# EAGLE design device (EAGLE 6.6.0)
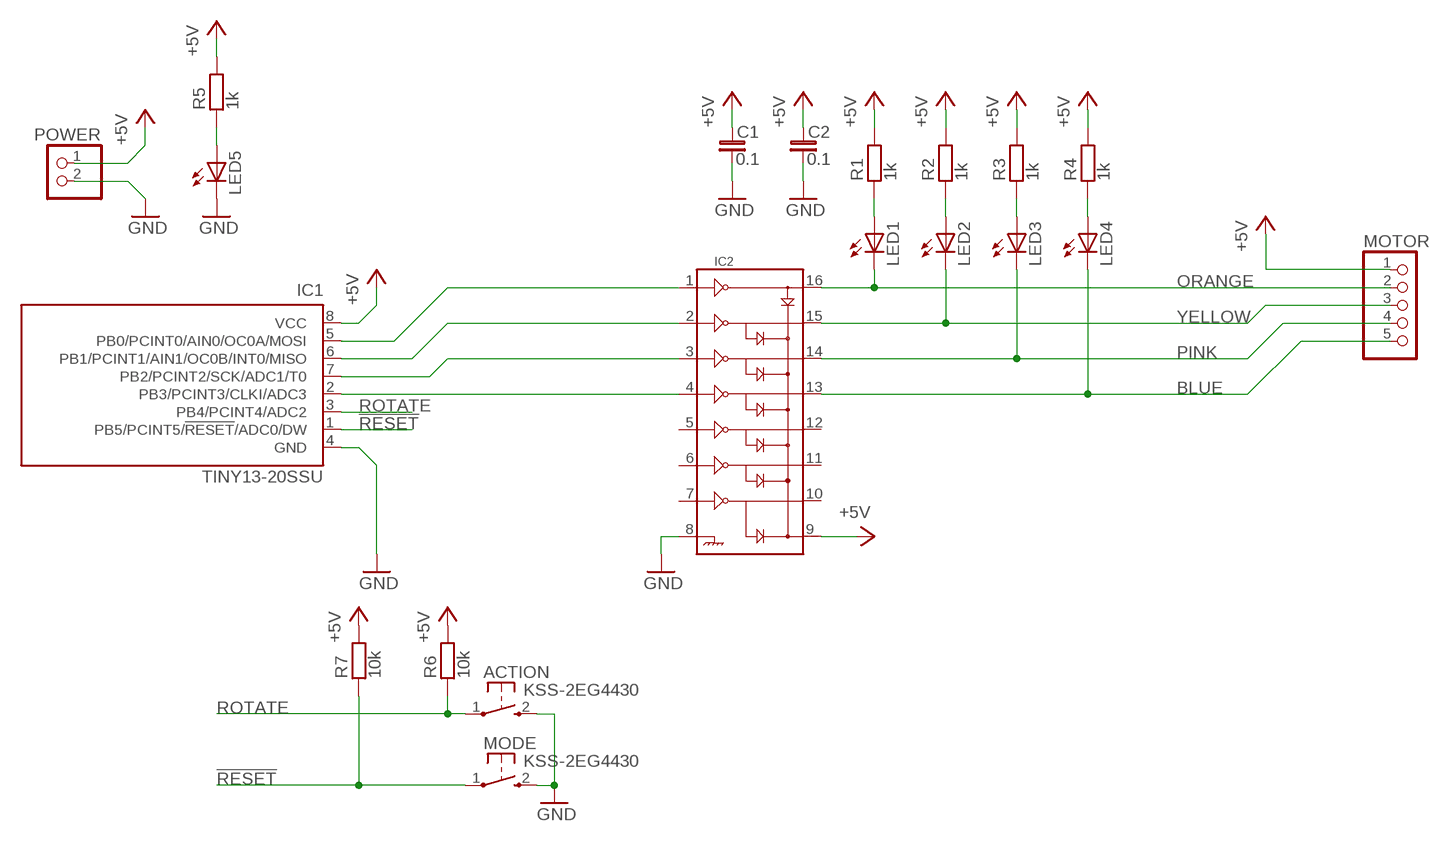
[diagram p0: schematic, sheet 1]

## Parts
ACTION  KSS-2EG4430  [KSS-2EG4430]
C1  0.1  C_0805  [C0805]
C2  0.1  C_0805  [C0805]
IC1  TINY13-20SSU  [8S1]
IC2  ULN2003D  [SO16]
LED1  LEDCHIPLED_0805  [CHIPLED_0805]
LED2  LEDCHIPLED_0805  [CHIPLED_0805]
LED3  LEDCHIPLED_0805  [CHIPLED_0805]
LED4  LEDCHIPLED_0805  [CHIPLED_0805]
LED5  LEDCHIPLED_0805  [CHIPLED_0805]
MODE  KSS-2EG4430  [KSS-2EG4430]
MOTOR  PINHD-1X5_2.54  [1X05]
POWER  PINHD-1X2_2.54  [1X02]
R1  1k  R_0805  [R0805]
R2  1k  R_0805  [R0805]
R3  1k  R_0805  [R0805]
R4  1k  R_0805  [R0805]
R5  1k  R_0805  [R0805]
R6  10k  R_0805  [R0805]
R7  10k  R_0805  [R0805]

## Nets
!RESET: IC1.1(PB5/PCINT5/!RESET!/ADC0/DW) MODE.1(P) R7.1
+5V: C1.1 C2.1 IC1.8(VCC) IC2.9 MOTOR.1 POWER.1 R1.2 R2.2 R3.2 R4.2 R5.2 R6.2 R7.2
BLUE: IC2.13 LED4.C MOTOR.5
GND: ACTION.2(S) C1.2 C2.2 IC1.4(GND) IC2.8 LED5.C MODE.2(S) POWER.2
N$1: LED1.A R1.1
N$2: LED2.A R2.1
N$3: LED3.A R3.1
N$4: LED4.A R4.1
N$5: LED5.A R5.1
N$6: IC1.5(PB0/PCINT0/AIN0/OC0A/MOSI) IC2.1
N$7: IC1.6(PB1/PCINT1/AIN1/OC0B/INT0/MISO) IC2.2
N$8: IC1.7(PB2/PCINT2/SCK/ADC1/T0) IC2.3
N$9: IC1.2(PB3/PCINT3/CLKI/ADC3) IC2.4
ORANGE: IC2.16 LED1.C MOTOR.2
PINK: IC2.14 LED3.C MOTOR.4
ROTATE: ACTION.1(P) IC1.3(PB4/PCINT4/ADC2) R6.1
YELLOW: IC2.15 LED2.C MOTOR.3
Unconnected: IC2.5 IC2.6 IC2.7 IC2.10 IC2.11 IC2.12

## Library data of the parts
ACTION MODE = buttons:KSS-2EG4430: Size: 3x6mm Height: 5mm from PCB Rating: DC12v 50mA Travel: 0.25±0.10mm Operating Force: 180±50gf Return Force: 60gf min Contact resistance: 100m? max Insulation resistance: 100M? min Operating life?50,000 cycles
C1 C2 = rc-master-smd:C_: NON-POLARIZED CAP
IC1 = avr:TINY13: 8-bit AVR Microcontroller with 1K Bytes In-System Programmable Flash Source: http://www.atmel.com/dyn/resources/prod_documents/2535S.pdf
IC2 = transistor-arrays:ULN2003: OUTPUT CURRENT 500mA PER DRIVER (600mA PEAK) OUTPUT VOLTAGE 50V
LED1-LED5 = led:LED: LED OSRAM: - CHIPLED LG R971, LG N971, LY N971, LG Q971, LY Q971, LO R971, LY R971 LH N974, LH R974 LS Q976, LO Q976, LY Q976 LO Q996 - Hyper CHIPLED LW Q18S LB Q993, LB Q99A, LB R99A - SideLED LS A670, LO A670, LY A670, LG A670, LP A670 LB A673, LV A673, LT A673, LW A673 LH A674 LY A675 LS A676, LA A676, LO A676, LY A676, LW A676 LS A679, LY A679, LG A679 - Hyper Micro SIDELED® LS Y876, LA Y876, LO Y876, LY Y876 LT Y87S - SmartLED LW L88C, LW L88S LB L89C, LB L89S, LG L890 LS L89K, LO L89K, LY L89K LS L896, LA L896, LO L896, LY L896 - TOPLED LS T670, LO T670, LY T670, LG T670, LP T670 LSG T670, LSP T670, LSY T670, LOP T670, LYG T670 LG T671, LOG T671, LSG T671 LB T673, LV T673, LT T673, LW T673 LH T674 LS T676, LA T676, LO T676, LY T676, LB T676, LH T676, LSB T676, LW T676 LB T67C, LV T67C, LT T67C, LS T67K, LO T67K, LY T67K, LW E67C LS E67B, LA E67B, LO E67B, LY E67B, LB E67C, LV E67C, LT E67C LW T67C LS T679, LY T679, LG T679 LS T770, LO T770, LY T770, LG T770, LP T770 LB T773, LV T773, LT T773, LW T773 LH T774 LS E675, LA E675, LY E675, LS T675 LS T776, LA T776, LO T776, LY T776, LB T776 LHGB T686 LT T68C, LB T68C - Hyper Mini TOPLED® LB M676 - Mini TOPLED Santana® LG M470 LS M47K, LO M47K, LY M47K Source: http://www.osram.convergy.de - LUMILED® LXK2-PW12-R00, LXK2-PW12-S00, LXK2-PW14-U00, LXK2-PW14-V00 LXK2-PM12-R00, LXK2-PM12-S00, LXK2-PM14-U00 LXK2-PE12-Q00, LXK2-PE12-R00, LXK2-PE12-S00, LXK2-PE14-T00, LXK2-PE14-U00 LXK2-PB12-K00, LXK2-PB12-L00, LXK2-PB12-M00, LXK2-PB14-N00, LXK2-PB14-P00, LXK2-PB14-Q00 LXK2-PR12-L00, LXK2-PR12-M00, LXK2-PR14-Q00, LXK2-PR14-R00 LXK2-PD12-Q00, LXK2-PD12-R00, LXK2-PD12-S00 LXK2-PH12-R00, LXK2-PH12-S00 LXK2-PL12-P00, LXK2-PL12-Q00, LXK2-PL12-R00 Source: www.luxeon.com
MOTOR = pinhead-fixdrills:PINHD-1X5: PIN HEADER
POWER = pinhead-fixdrills:PINHD-1X2: PIN HEADER
R1-R7 = rc-master-smd:R_: RESISTOR

## Board
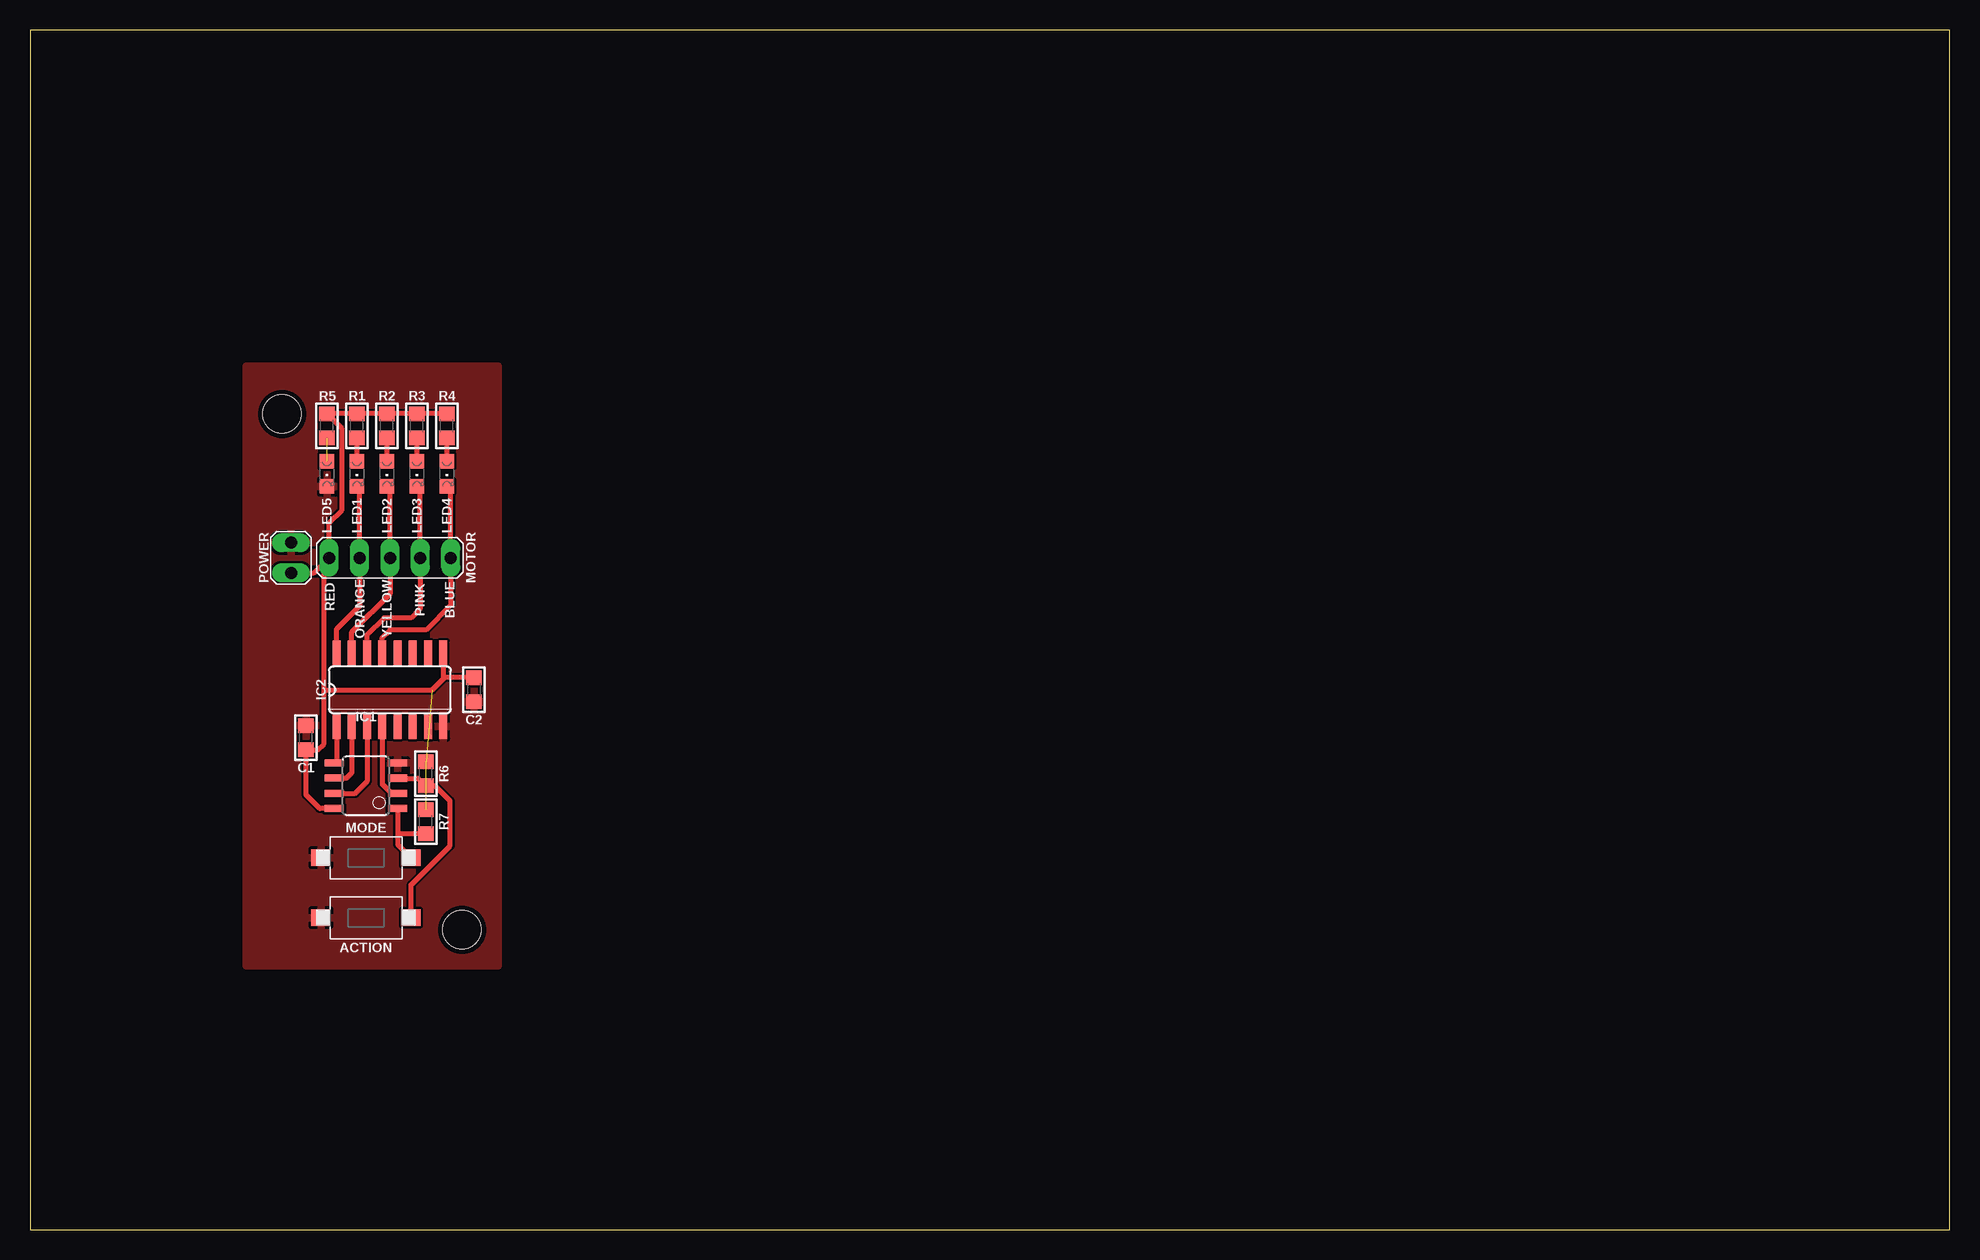
[diagram p1: board, top side]

Size 160 x 100 mm. Coordinates in mm from the lower left corner, seen from the top.
Outline: 0,0 160,0 160,100 0,100 0,0
Copper layers (1*16): Top 0.018mm / dielectric 1.5011mm / Bottom 0.018mm
Design rules "tepro-speed-18mkm": minimum track width 0.2mm, minimum drill 0.4mm, track to track 0.2mm, track to pad 0.2mm, pad to pad 0.2mm, via to via 0.2mm, smd to smd 0.2mm, copper to edge 0.4mm, drill to drill 0.4mm, minimum pad ring 0.2mm, minimum via ring 0.2mm, stop-mask expansion 4mil, vias tented up to drill 0.2mm, thermal gap 10mil
Holes 3.2 mm at 21,68 36,25

### Footprints (pad centres in the part's own frame; a part is rotated, then mirrored left to right if it is on the bottom)
KSS-2EG4430 = smd 1.6 x 1.4: 1 -3.75,0; 2 3.75,0
C0805 = smd 1.2 x 1.3: 1 -1.016,0; 2 1.016,0
8S1 = smd 0.6 x 1.6: 1 -1.905,-2.654; 2 -0.645,-2.654; 3 0.625,-2.654; 4 1.895,-2.654; 5 1.905,2.654; 6 0.635,2.654; 7 -0.635,2.654; 8 -1.905,2.654
SO16 = smd 0.66 x 2.032: 1 -4.445,-3.073; 2 -3.175,-3.073; 3 -1.905,-3.073; 4 -0.635,-3.073; 5 0.635,-3.073; 6 1.905,-3.073; 7 3.175,-3.073; 8 4.445,-3.073; 9 4.445,3.073; 10 3.175,3.073; 11 1.905,3.073; 12 0.635,3.073; 13 -0.635,3.073; 14 -1.905,3.073; 15 -3.175,3.073; 16 -4.445,3.073
CHIPLED_0805 = smd 1.2 x 1.2: A 0,-1.05; C 0,1.05
1X05 = drill 1 long: 1 -5.08,0; 2 -2.54,0; 3 0,0; 4 2.54,0; 5 5.08,0
1X02 = drill 1 long: 1 -1.27,0; 2 1.27,0
R0805 = smd 1.2 x 1.3: 1 -1.016,0; 2 1.016,0

### Placement (x,y rotation side)
ACTION  28,26 180 top
C1  23,41 90 top
C2  37,45 270 top
IC1  28,37 90 top
IC2  30,45 0 top
LED1  27.25,63 180 top
LED2  29.75,63 180 top
LED3  32.25,63 180 top
LED4  34.75,63 180 top
LED5  24.75,63 180 top
MODE  28,31 180 top
MOTOR  30,56 0 top
POWER  21.75,56 90 top
R1  27.25,67 90 top
R2  29.75,67 90 top
R3  32.25,67 90 top
R4  34.75,67 90 top
R5  24.75,67 90 top
R6  33,38 90 top
R7  33,34 90 top

### Tracks (layer width: path | path; a pad name or v marks a point on that pad's centre or on a via)
!RESET
  Top 0.406: IC1.1 30.65,33 | 30.65,33 30.65,32.1 MODE.1 | R7.1 30.67,32.98 30.65,33
+5V  (2 unrouted)
  Top 0.406: 24.5,45 33.5,45 34.5,46 | IC2.9 34.45,46.05 34.5,46 | C2.1 34.52,46.02 34.5,46 | 24.5,45 24.5,40.5 23.98,39.98 C1.1 23,36.25 24.16,35.09 IC1.8 | MOTOR.1 24.92,58.92 26,60 26,66.77 R5.2 R1.2 R2.2 R3.2 R4.2 | POWER.1 23.65,54.73 MOTOR.1 | 24.5,45 24.5,55.58 MOTOR.1
BLUE
  Top 0.406: IC2.13 29.36,49.37 30,50 33,50 35.08,52.08 MOTOR.5 35.08,61.62 LED4.C
GND
  pour Top: 18,72 39,72 39,22 18,22
N$1
  Top 0.406: LED1.A R1.1
N$2
  Top 0.406: LED2.A R2.1
N$3
  Top 0.406: LED3.A R3.1
N$4
  Top 0.406: LED4.A R4.1
N$5  (1 unrouted)
N$6
  Top 0.406: IC2.1 25.55,39.11 IC1.5
N$7
  Top 0.406: IC1.6 26.39,37.63 26.82,38.08 IC2.2
N$8
  Top 0.406: IC1.7 27.11,36.37 28.09,37.34 IC2.3
N$9
  Top 0.406: IC1.2 30.14,36.35 29.36,37.13 IC2.4
ORANGE
  Top 0.406: IC2.16 25.55,50.05 27.46,51.96 MOTOR.2 27.46,61.74 LED1.C
PINK
  Top 0.406: IC2.14 28.09,49.59 29.5,51 31.75,51 32.54,51.79 MOTOR.4 32.54,61.66 LED3.C
ROTATE
  Top 0.406: IC1.3 32.36,37.62 R6.1 33.02,37 33.75,37 35,35.75 35,32 31.75,28.75 ACTION.1
YELLOW
  Top 0.406: IC2.15 26.82,49.83 30,53 MOTOR.3 30,61.7 LED2.C

### Text on the board
tNames: RED | ORANGE | YELLOW | PINK | BLUE